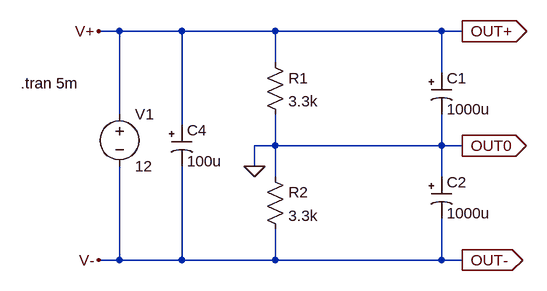
[diagram p0: schematic Circuit7_25.asc]
Circuit7_25.asc, the LTspice schematic file:
Version 4
SHEET 1 988 680
WIRE 112 128 80 128
WIRE 208 128 112 128
WIRE 352 128 208 128
WIRE 608 128 352 128
WIRE 640 128 608 128
WIRE 352 176 352 128
WIRE 608 192 608 128
WIRE 112 256 112 128
WIRE 208 272 208 128
WIRE 352 304 352 256
WIRE 352 304 320 304
WIRE 608 304 608 256
WIRE 608 304 352 304
WIRE 640 304 608 304
WIRE 320 336 320 304
WIRE 352 352 352 304
WIRE 608 352 608 304
WIRE 112 480 112 336
WIRE 112 480 80 480
WIRE 208 480 208 336
WIRE 208 480 112 480
WIRE 352 480 352 432
WIRE 352 480 208 480
WIRE 608 480 608 416
WIRE 608 480 352 480
WIRE 640 480 608 480
FLAG 320 336 0
FLAG 640 128 OUT+
IOPIN 640 128 Out
FLAG 640 480 OUT-
IOPIN 640 480 Out
FLAG 640 304 OUT0
IOPIN 640 304 Out
FLAG 80 128 V+
FLAG 80 480 V-
SYMBOL voltage 112 240 R0
SYMATTR InstName V1
SYMATTR Value 12
SYMBOL res 336 160 R0
SYMATTR InstName R1
SYMATTR Value 3.3k
SYMBOL res 336 336 R0
SYMATTR InstName R2
SYMATTR Value 3.3k
SYMBOL polcap 592 192 R0
SYMATTR InstName C1
SYMATTR Value 1000u
SYMBOL polcap 592 352 R0
SYMATTR InstName C2
SYMATTR Value 1000u
SYMBOL polcap 192 272 R0
SYMATTR InstName C4
SYMATTR Value 100u
TEXT -40 208 Left 2 !.tran 5m

The netlist it stands for:
* Circuit7_25.asc
V1 V+ V- 12
R1 V+ 0 3.3k
R2 0 V- 3.3k
C1 V+ 0 1000u
C2 0 V- 1000u
C4 V+ V- 100u
.tran 5m
.backanno
.end